# EAGLE schematic hovercraft (EAGLE 6.6.0)
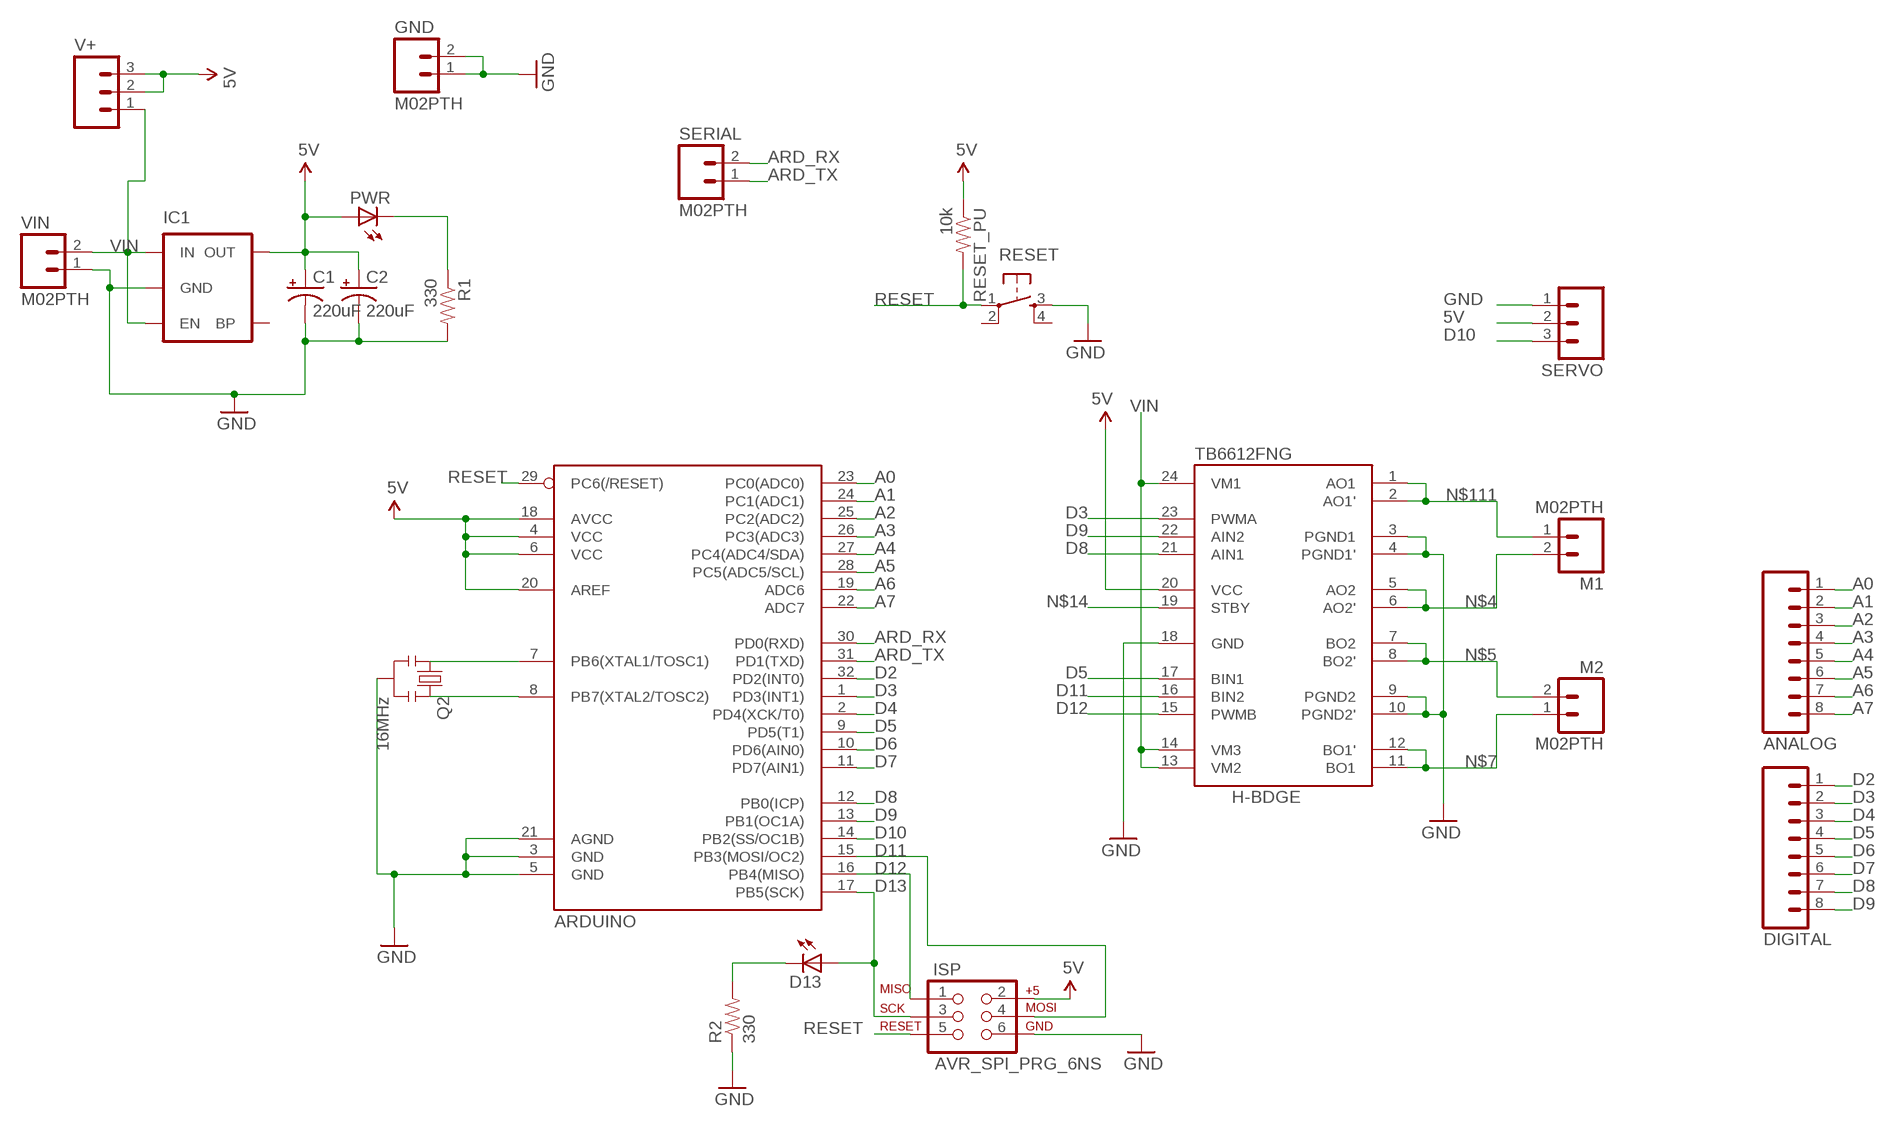
[diagram p0: schematic, sheet 1]

## Parts
ANALOG  M08LOCK  [1X08_LOCK]
ARDUINO  ATMEGA328_SMT  [TQFP32-08]
C1  220uF  CAP_POLPTH1  [CPOL-RADIAL-100UF-25V]
C2  220uF  CAP_POLPTH1  [CPOL-RADIAL-100UF-25V]
D13  LEDCHIPLED_0805  [CHIPLED_0805]
DIGITAL  M08LOCK  [1X08_LOCK]
GND  M02PTH  [1X02]
H-BDGE  TB6612FNG  [SSOP24]
IC1  MIC52055V  [SOT23-5]
ISP  AVR_SPI_PRG_6NS  [2X3-NS]
M1  M02PTH  [1X02]
M2  M02PTH  [1X02]
PWR  LEDCHIPLED_0805  [CHIPLED_0805]
Q2  16MHz  RESONATOR16MHZ  [RESONATOR-SMD]
R1  330  RESISTOR0805-RES  [0805]
R2  330  RESISTOR0805-RES  [0805]
RESET  TAC_SWITCHSMD  [TACTILE_SWITCH_SMD]
RESET_PU  10k  RESISTOR0805-RES  [0805]
SERIAL  M02PTH  [1X02]
SERVO  M03PTH  [1X03]
V+  M03PTH  [1X03]
VIN  M02PTH  [1X02]

## Nets
5V: ARDUINO.4(VCC) ARDUINO.6(VCC) ARDUINO.18(AVCC) ARDUINO.20(AREF) C1.1(+) C2.1(+) H-BDGE.20(VCC) IC1.5(OUT) ISP.2 PWR.A RESET_PU.1 SERVO.2 V+.2 V+.3
A0: ANALOG.1 ARDUINO.23(PC0(ADC0))
A1: ANALOG.2 ARDUINO.24(PC1(ADC1))
A2: ANALOG.3 ARDUINO.25(PC2(ADC2))
A3: ANALOG.4 ARDUINO.26(PC3(ADC3))
A4: ANALOG.5 ARDUINO.27(PC4(ADC4/SDA))
A5: ANALOG.6 ARDUINO.28(PC5(ADC5/SCL))
A6: ANALOG.7 ARDUINO.19(ADC6)
A7: ANALOG.8 ARDUINO.22(ADC7)
ARD_RX: ARDUINO.30(PD0(RXD)) SERIAL.2
ARD_TX: ARDUINO.31(PD1(TXD)) SERIAL.1
D2: ARDUINO.32(PD2(INT0)) DIGITAL.1
D3: ARDUINO.1(PD3(INT1)) DIGITAL.2 H-BDGE.23(PWMA)
D4: ARDUINO.2(PD4(XCK/T0)) DIGITAL.3
D5: ARDUINO.9(PD5(T1)) DIGITAL.4 H-BDGE.17(BIN1)
D6: ARDUINO.10(PD6(AIN0)) DIGITAL.5
D7: ARDUINO.11(PD7(AIN1)) DIGITAL.6
D8: ARDUINO.12(PB0(ICP)) DIGITAL.7 H-BDGE.21(AIN1)
D9: ARDUINO.13(PB1(OC1A)) DIGITAL.8 H-BDGE.22(AIN2)
D10: ARDUINO.14(PB2(SS/OC1B)) SERVO.3
D11: ARDUINO.15(PB3(MOSI/OC2)) H-BDGE.16(BIN2) ISP.4
D12: ARDUINO.16(PB4(MISO)) H-BDGE.15(PWMB) ISP.1
D13: ARDUINO.17(PB5(SCK)) D13.A ISP.3
GND: ARDUINO.3(GND) ARDUINO.5(GND) ARDUINO.21(AGND) C1.2(-) C2.2(-) GND.1 GND.2 H-BDGE.3(PGND1) H-BDGE.4(PGND1') H-BDGE.9(PGND2) H-BDGE.10(PGND2') H-BDGE.18(GND) IC1.2(GND) ISP.6 Q2.2 R1.2 R2.1 RESET.3 SERVO.1 VIN.1
N$1: PWR.C R1.1
N$3: D13.C R2.2
N$4: H-BDGE.5(AO2) H-BDGE.6(AO2') M1.2
N$5: H-BDGE.7(BO2) H-BDGE.8(BO2') M2.2
N$7: H-BDGE.11(BO1) H-BDGE.12(BO1') M2.1
N$9: ARDUINO.7(PB6(XTAL1/TOSC1)) Q2.1
N$10: ARDUINO.8(PB7(XTAL2/TOSC2)) Q2.3
N$14: H-BDGE.19(STBY)
N$111: H-BDGE.1(AO1) H-BDGE.2(AO1') M1.1
RESET: ARDUINO.29(PC6(/RESET)) ISP.5 RESET.1 RESET_PU.2
VIN: H-BDGE.13(VM2) H-BDGE.14(VM3) H-BDGE.24(VM1) IC1.1(IN) IC1.3(EN) V+.1 VIN.2
Unconnected: IC1.4(BP) RESET.2 RESET.4

## Library data of the parts
ANALOG DIGITAL = SparkFun-Connectors:M08: Header 8 Standard 8-pin 0.1" header. Use with straight break away headers (SKU : PRT-00116), right angle break away headers (PRT-00553), swiss pins (PRT-00743), machine pins (PRT-00117), and female headers (PRT-00115).
ARDUINO = SparkFun-DigitalIC:ATMEGA328_SMT: 32-Pin Atmega328 part Commonly used on Arduino compatible boards Available in QFP and QFN packages TQFP is IC-09069 QFN is non-stock; PROD_ID: IC-09069; VALUE: ATMEGA328P
C1 C2 = SparkFun-Capacitors:CAP_POL: Capacitor Polarized These are standard SMD and PTH capacitors. Normally 10uF, 47uF, and 100uF in electrolytic and tantalum varieties. Always verify the external diameter of the through hole cap, it varies with capacity, voltage, and manufacturer. The EIA devices should be standard.
D13 PWR = led:LED: LED OSRAM: - CHIPLED LG R971, LG N971, LY N971, LG Q971, LY Q971, LO R971, LY R971 LH N974, LH R974 LS Q976, LO Q976, LY Q976 LO Q996 - Hyper CHIPLED LW Q18S LB Q993, LB Q99A, LB R99A - SideLED LS A670, LO A670, LY A670, LG A670, LP A670 LB A673, LV A673, LT A673, LW A673 LH A674 LY A675 LS A676, LA A676, LO A676, LY A676, LW A676 LS A679, LY A679, LG A679 - Hyper Micro SIDELED® LS Y876, LA Y876, LO Y876, LY Y876 LT Y87S - SmartLED LW L88C, LW L88S LB L89C, LB L89S, LG L890 LS L89K, LO L89K, LY L89K LS L896, LA L896, LO L896, LY L896 - TOPLED LS T670, LO T670, LY T670, LG T670, LP T670 LSG T670, LSP T670, LSY T670, LOP T670, LYG T670 LG T671, LOG T671, LSG T671 LB T673, LV T673, LT T673, LW T673 LH T674 LS T676, LA T676, LO T676, LY T676, LB T676, LH T676, LSB T676, LW T676 LB T67C, LV T67C, LT T67C, LS T67K, LO T67K, LY T67K, LW E67C LS E67B, LA E67B, LO E67B, LY E67B, LB E67C, LV E67C, LT E67C LW T67C LS T679, LY T679, LG T679 LS T770, LO T770, LY T770, LG T770, LP T770 LB T773, LV T773, LT T773, LW T773 LH T774 LS E675, LA E675, LY E675, LS T675 LS T776, LA T776, LO T776, LY T776, LB T776 LHGB T686 LT T68C, LB T68C - Hyper Mini TOPLED® LB M676 - Mini TOPLED Santana® LG M470 LS M47K, LO M47K, LY M47K Source: http://www.osram.convergy.de LUXEON: - LUMILED® LXK2-PW12-R00, LXK2-PW12-S00, LXK2-PW14-U00, LXK2-PW14-V00 LXK2-PM12-R00, LXK2-PM12-S00, LXK2-PM14-U00 LXK2-PE12-Q00, LXK2-PE12-R00, LXK2-PE12-S00, LXK2-PE14-T00, LXK2-PE14-U00 LXK2-PB12-K00, LXK2-PB12-L00, LXK2-PB12-M00, LXK2-PB14-N00, LXK2-PB14-P00, LXK2-PB14-Q00 LXK2-PR12-L00, LXK2-PR12-M00, LXK2-PR14-Q00, LXK2-PR14-R00 LXK2-PD12-Q00, LXK2-PD12-R00, LXK2-PD12-S00 LXK2-PH12-R00, LXK2-PH12-S00 LXK2-PL12-P00, LXK2-PL12-Q00, LXK2-PL12-R00 Source: www.luxeon.com KINGBRIGHT: KA-3528ASYC Source: www.kingbright.com
GND M1 M2 SERIAL VIN = SparkFun-Connectors:M02: Standard 2-pin 0.1" header. Use with - straight break away headers ( PRT-00116) - right angle break away headers (PRT-00553) - swiss pins (PRT-00743) - machine pins (PRT-00117) - female headers (PRT-00115) Molex polarized connector foot print use with: PRT-08233 with associated crimp pins and housings. 2.54_SCREWTERM for use with PRT-10571. 3.5mm Screw Terminal footprints for PRT-08084 5mm Screw Terminal footprints for use with PRT-08433
H-BDGE = adafruit:TB6612FNG: TB6612FNG MOS dual H-bridge motor driver, 1.2A current 3.2A peak 3 or 5v logic and 3-15v motor
IC1 = SparkFun-PowerIC:MIC5205: MIC5205 150mA vreg 3.3V - VREG-00822 5V - VREG-00823; PROD_ID: VREG-00823
ISP = SparkFun-Connectors:AVR_SPI_PRG_6: AVR ISP 6 Pin This is the reduced ISP connector for AVR programming. Common on Arduino. This footprint will take up less PCB space and can be used with a 10-pin to 6-pin adapter such as SKU: BOB-08508
Q2 = SparkFun-FreqCtrl:RESONATOR: Resonator Small SMD resonator. Used, eg, on the Arduino Pro/ Pro Mini boards. 8MHz- XTAL-08895 16MHz- XTAL-08900; PROD_ID: XTAL-08900
R1 R2 RESET_PU = SparkFun-Resistors:RESISTOR: Resistor Basic schematic elements and footprints for 0603, 1206, and PTH resistors.
RESET = SparkFun-Electromechanical:TAC_SWITCH: Momentary Switch Button commonly used for reset or general input. Spark Fun Electronics SKU : COM-00097 SMT- SWCH-08247; PROD_ID: SWCH-08247
SERVO V+ = SparkFun-Connectors:M03: Header 3 Standard 3-pin 0.1" header. Use with straight break away headers (SKU : PRT-00116), right angle break away headers (PRT-00553), swiss pins (PRT-00743), machine pins (PRT-00117), and female headers (PRT-00115). Molex polarized connector foot print use with SKU : PRT-08232 with associated crimp pins and housings.

## Net classes
0 default: clearance 0.205 mm